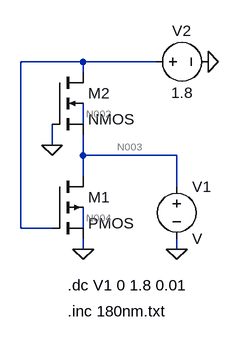
[diagram p0: schematic Draft4.asc]
Draft4.asc, the LTspice schematic file:
Version 4
SHEET 1 880 680
WIRE 192 16 96 16
WIRE 304 16 192 16
WIRE 192 32 192 16
WIRE 192 112 192 80
WIRE 144 144 144 112
WIRE 192 160 192 128
WIRE 336 160 192 160
WIRE 192 192 192 160
WIRE 336 208 336 160
WIRE 96 272 96 16
WIRE 144 272 96 272
WIRE 192 272 192 240
WIRE 192 304 192 288
WIRE 336 304 336 288
FLAG 192 304 0
FLAG 336 304 0
FLAG 144 144 0
FLAG 384 16 0
SYMBOL pmos4 144 192 R0
SYMATTR InstName M1
SYMATTR Value2 l=.18u w=5u
SYMBOL nmos4 144 32 R0
SYMATTR InstName M2
SYMATTR Value2 l=.18u w=5u
SYMBOL voltage 336 192 R0
SYMATTR InstName V1
SYMBOL voltage 288 16 R270
WINDOW 0 32 56 VTop 2
WINDOW 3 -32 56 VBottom 2
WINDOW 123 0 0 Left 2
WINDOW 39 0 0 Left 2
SYMATTR InstName V2
SYMATTR Value 1.8
TEXT 168 360 Left 2 !.dc V1 0 1.8 0.01
TEXT 168 400 Left 2 !.inc 180nm.txt

The netlist it stands for:
* Draft4.asc
M1 N003 N001 0 N004 PMOS l=.18u w=5u
M2 N001 0 N003 N002 NMOS l=.18u w=5u
V1 N003 0 V
V2 N001 0 1.8
.model NMOS NMOS
.model PMOS PMOS
.lib standard.mos
.dc V1 0 1.8 0.01
.inc 180nm.txt
.backanno
.end

* Results of the author's LTspice run, read from the files saved beside the schematic
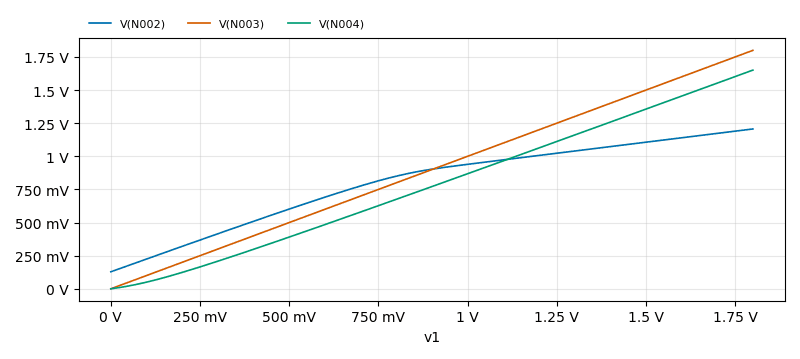
[diagram p1: DC transfer characteristic of Draft4.asc, plotted from the saved traces]
* DC transfer characteristic, 1 run:
*   V(N002): 128.4 mV at v1=0 V, 1.207 V at v1=1.8 V, min 128.4 mV, max 1.207 V
*   V(N003): 0 V at v1=0 V, 1.8 V at v1=1.8 V, min 0 V, max 1.8 V
*   V(N004): -5.172e-17 fV at v1=0 V, 1.651 V at v1=1.8 V, min -5.172e-17 fV, max 1.651 V